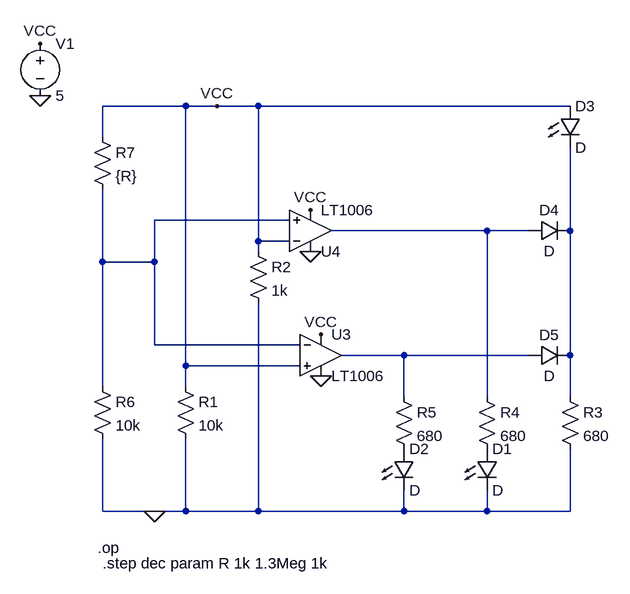
[diagram p0: schematic LDR archi.asc]
LDR archi.asc, the LTspice schematic file:
Version 4
SHEET 1 880 680
WIRE 176 -80 48 -80
WIRE 224 -80 176 -80
WIRE 288 -80 224 -80
WIRE 768 -80 288 -80
WIRE 48 -32 48 -80
WIRE 336 96 128 96
WIRE 640 112 400 112
WIRE 704 112 640 112
WIRE 768 112 768 -16
WIRE 288 128 288 -80
WIRE 336 128 288 128
WIRE 288 144 288 128
WIRE 48 160 48 48
WIRE 128 160 128 96
WIRE 128 160 48 160
WIRE 128 288 128 160
WIRE 352 288 128 288
WIRE 512 304 416 304
WIRE 704 304 512 304
WIRE 768 304 768 112
WIRE 176 320 176 -80
WIRE 352 320 176 320
WIRE 48 352 48 160
WIRE 176 352 176 320
WIRE 512 368 512 304
WIRE 640 368 640 112
WIRE 768 368 768 304
WIRE 48 544 48 432
WIRE 128 544 48 544
WIRE 176 544 176 432
WIRE 176 544 128 544
WIRE 288 544 288 224
WIRE 288 544 176 544
WIRE 512 544 512 512
WIRE 512 544 288 544
WIRE 640 544 640 512
WIRE 640 544 512 544
WIRE 768 544 768 448
WIRE 768 544 640 544
FLAG -48 -96 0
FLAG -48 -176 VCC
FLAG 368 80 VCC
FLAG 384 272 VCC
FLAG 368 144 0
FLAG 128 544 0
FLAG 224 -80 VCC
FLAG 384 336 0
SYMBOL voltage -48 -192 R0
WINDOW 123 0 0 Left 0
WINDOW 39 0 0 Left 0
SYMATTR InstName V1
SYMATTR Value 5
SYMBOL res 160 336 R0
SYMATTR InstName R1
SYMATTR Value 10k
SYMBOL res 272 128 R0
SYMATTR InstName R2
SYMATTR Value 1k
SYMBOL LED 752 -80 R0
SYMATTR InstName D3
SYMBOL LED 496 448 R0
SYMATTR InstName D2
SYMBOL res 752 352 R0
SYMATTR InstName R3
SYMATTR Value 680
SYMBOL res 624 352 R0
SYMATTR InstName R4
SYMATTR Value 680
SYMBOL res 496 352 R0
SYMATTR InstName R5
SYMATTR Value 680
SYMBOL LED 624 448 R0
SYMATTR InstName D1
SYMBOL diode 704 128 R270
WINDOW 0 32 32 VTop 2
WINDOW 3 0 32 VBottom 2
SYMATTR InstName D4
SYMBOL diode 704 320 R270
WINDOW 0 32 32 VTop 2
WINDOW 3 0 32 VBottom 2
SYMATTR InstName D5
SYMBOL res 32 336 R0
SYMATTR InstName R6
SYMATTR Value 10k
SYMBOL res 32 -48 R0
SYMATTR InstName R7
SYMATTR Value {R}
SYMBOL Opamps\\LT1006 384 240 R0
SYMATTR InstName U3
SYMBOL Opamps\\LT1006 368 176 M180
SYMATTR InstName U4
TEXT 40 600 Left 2 !.op
TEXT 48 624 Left 2 !.step dec param R 1k 1.3Meg 1k

The netlist it stands for:
* LDR archi.asc
V1 VCC 0 5
R1 VCC 0 10k
R2 VCC 0 1k
D3 VCC N003 D
D2 P001 0 D
R3 N003 0 680
R4 N002 P002 680
R5 N004 P001 680
D1 P002 0 D
D4 N002 N003 D
D5 N004 N003 D
R6 N001 0 10k
R7 VCC N001 {R}
XU3 VCC N001 VCC 0 N004 LT1006  ; pins In+ In- V+ V- OUT
XU4 N001 VCC 0 VCC N002 LT1006  ; pins In+ In- V+ V- OUT
.model D D
.lib standard.dio
.op
.step dec param R 1k 1.3Meg 1k
.lib LTC.lib
.backanno
.end